# EAGLE board bmsmot (EAGLE 4.13), part 1 of 2
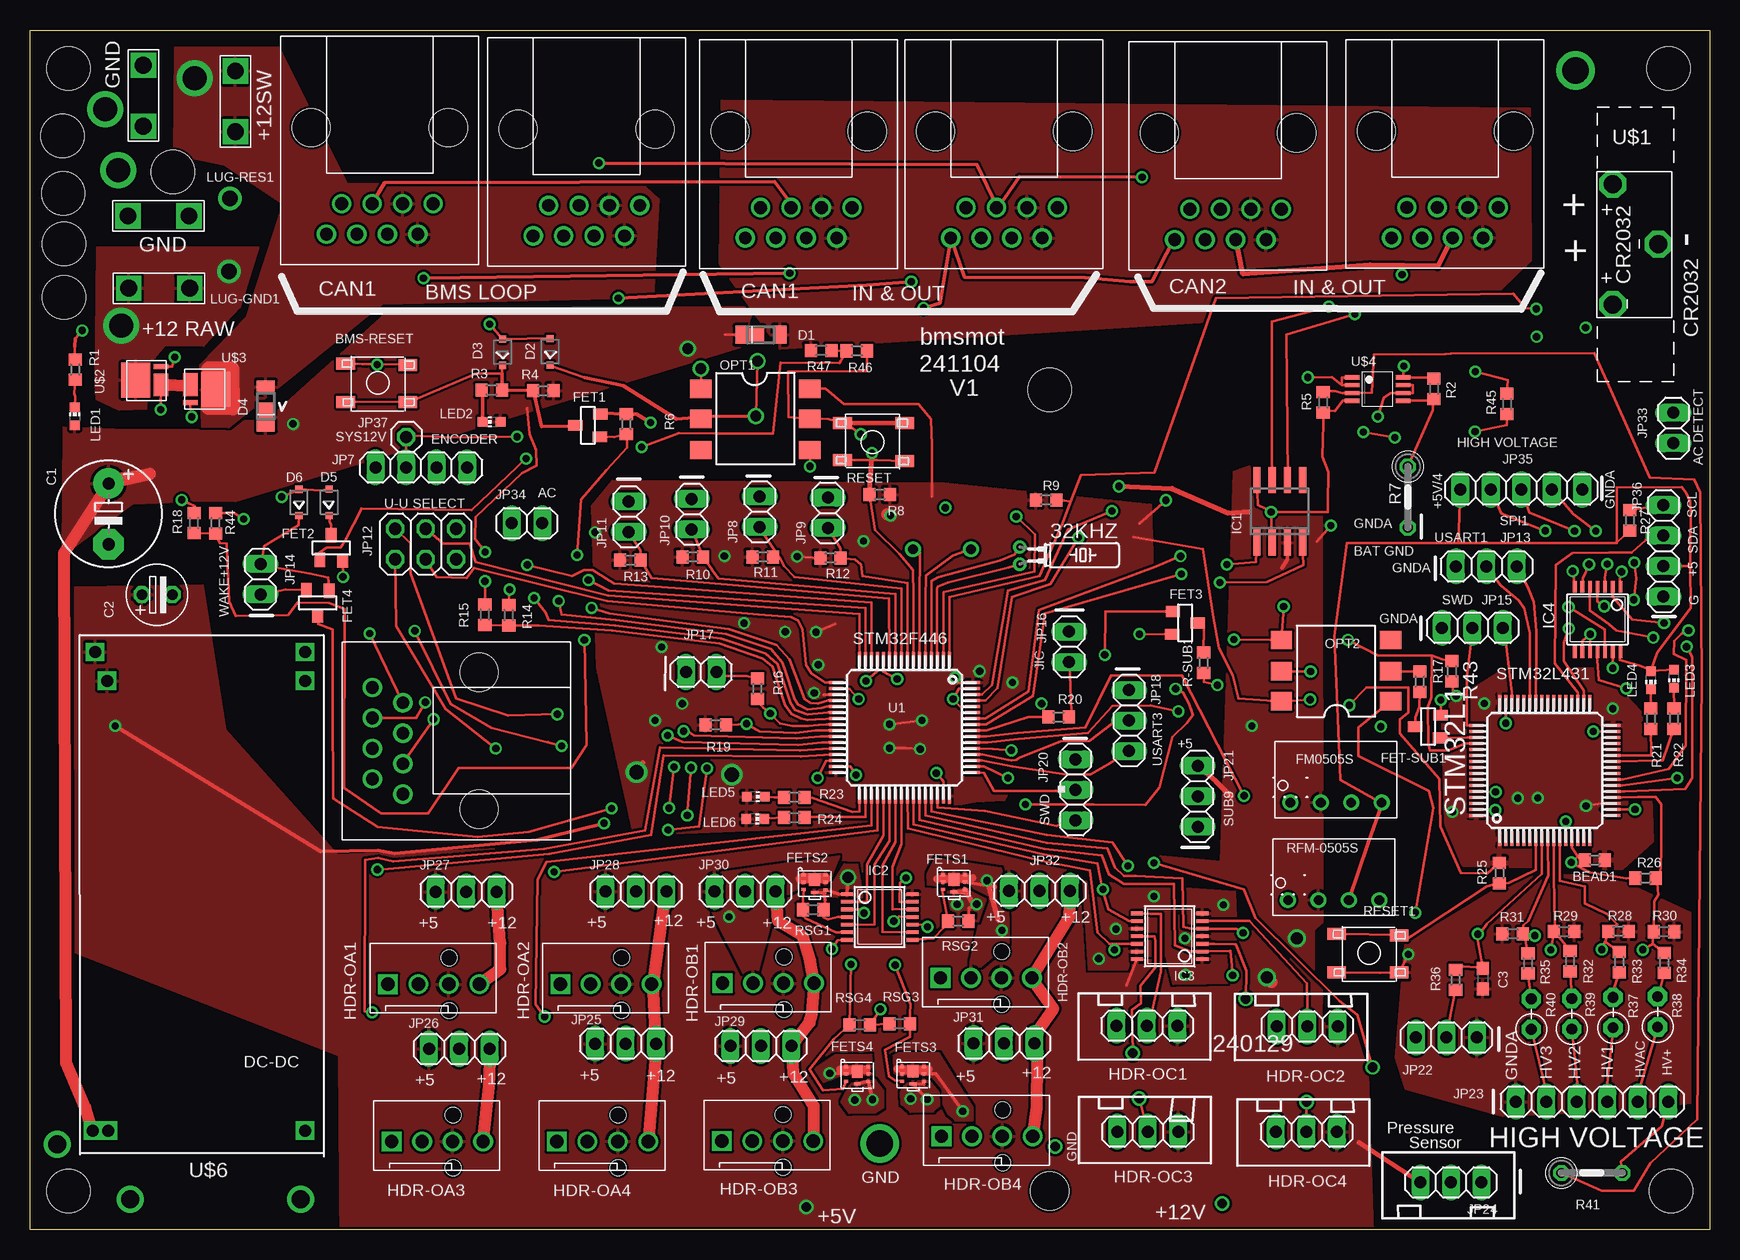
[diagram p2: board, top side]
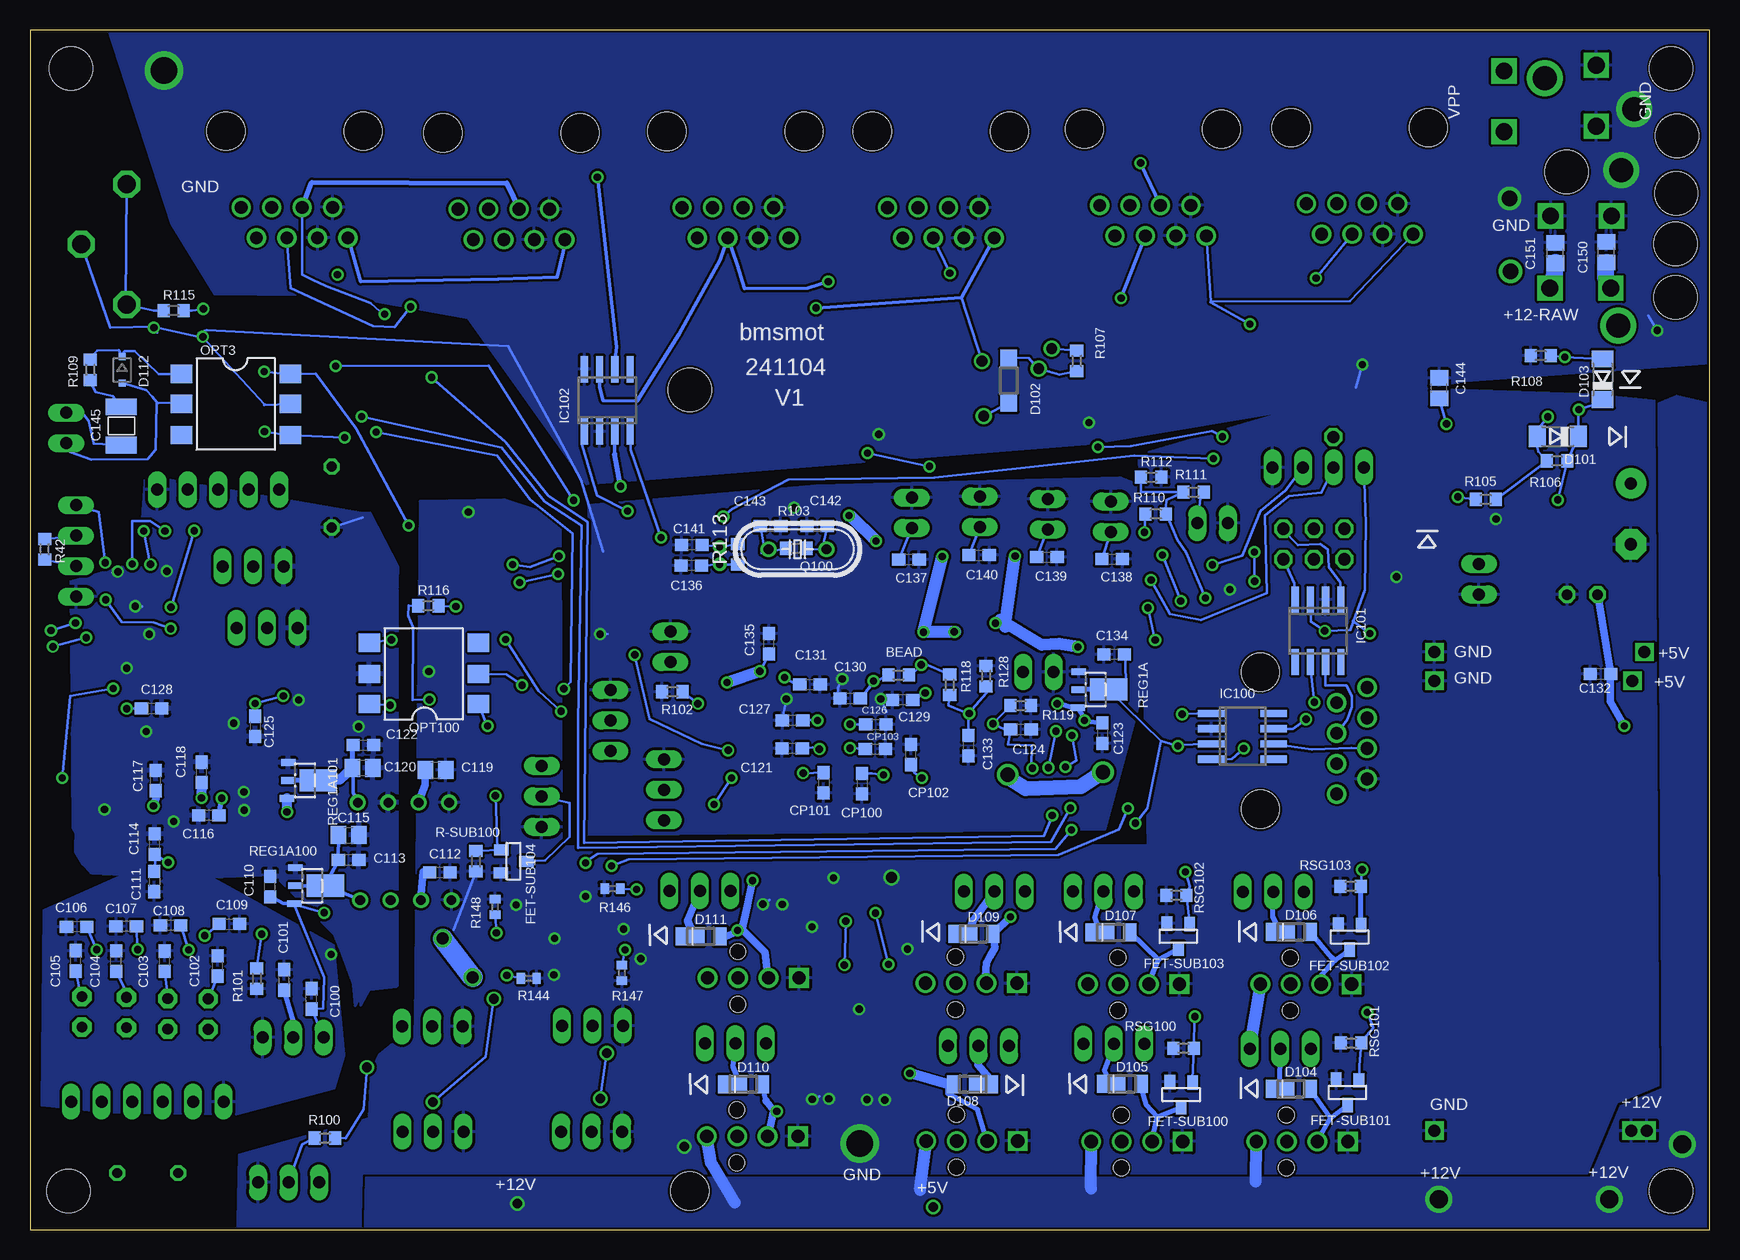
[diagram p3: board, bottom side, seen from below]

Size 140 x 100 mm. Coordinates in mm from the lower left corner, seen from the top.
Outline: 0,0 0,100 140,100 140,0 0,0
Copper layers (1*16): Top 0.035mm / dielectric 1.5mm / Bottom 0.035mm
Design rules "default": minimum track width 8mil, minimum drill 0.6mm, track to track 8mil, track to pad 8mil, pad to pad 8mil, via to via 8mil, smd to smd 0mil, copper to edge 8mil, drill to drill 8mil, minimum pad ring 10mil, minimum via ring 8mil, stop-mask expansion 4mil, vias tented up to drill 0mil, thermal gap 10mil
Holes 3.6 mm at 2.83,82.15 2.85,77.71 3.2,3.2 136.8,3.2 136.6,96.8 3.2,96.8 85,70 2.7,91.17 11.9,88.17 2.77,86.39
Holes 3.2 mm at 85,3.2

## Footprints (pad centres in the part's own frame; a part is rotated, then mirrored left to right if it is on the bottom)
32KHZ = drill 0.6 round: 1 -0.67,-3.1; 2 0.77,-3.1
SPADE_TAB = drill 1.4 square: G1 -2.54,0; G2 2.54,0
R0603 = smd 1 x 1.1: 1 -0.85,0; 2 0.85,0
E-SWITCH2 = smd 1.55 x 1: 1 -2.7,1.6; 2 2.5,1.5; 3 2.5,-1.6; 4 -2.7,-1.6
E5-8,5 = drill 1.016 pad 2.54 round: + -2.54,0 | drill 1.016 pad 2.54 octagon: - 2.54,0
ES-2,5L = drill 0.889 pad 1.27 octagon: 1 0,0; 2 2.54,0
C0603 = smd 1.1 x 1: 1 -0.85,0; 2 0.85,0
C0805 = smd 1.3 x 1.5: 1 -0.85,0; 2 0.85,0
1210 = smd 1.397 x 2.591: 1 -1.6,0; 2 1.6,0
POWERDI123 = smd 1.1 x 1.5: A 1,0 | smd 2.4 x 1.5: C -1.5,0
SOD323-R = smd 0.6 x 0.6: A 1.1,0; C -1.1,0
SOD80C = smd 1.4 x 1.8: A 1.7,0; C -1.7,0
SOD123 = smd 1.4 x 1.4: A 1.9,0; C -1.9,0
SOT-23 = smd 0.9 x 1.2: 1 -1,-1.006; 2 0.9,-1.056; 3 -0.05,1.056
DFN2020-6 = smd 0.33 x 0.25: D1 -0.925,0.4; D2 -0.925,-0.225; D5 0.925,-0.225; D6 0.925,0.4; G -0.925,-0.825; S1 0.925,-0.85 | smd 0.9 x 1.05: D7 0,0 | smd 0.56 x 0.25: S2 0,-1.05
DC-DC = drill 0.8 round: 1-GND 0,-1.27; 2-VIN 2.54,-1.27; 3-0V 5.08,-1.27; 4-VO 7.62,-1.27
1X4-MOLEXKK = drill 1.1 square: 1 3.81,0 | drill 1.1 round: 2 1.27,0; 3 -1.27,0; 4 -3.81,0 | hole 1.3: -1.3,2.2; -1.3,-2.2
1X03 = drill 1 long: 1 -2.54,0; 2 0,0; 3 2.54,0
SO-08 = smd 0.6 x 2.2: 1 -1.905,-2.6; 2 -0.635,-2.6; 3 0.635,-2.6; 4 1.905,-2.6; 5 1.905,2.6; 6 0.635,2.6; 7 -0.635,2.6; 8 -1.905,2.6
TSSOP14 = smd 0.305 x 0.991: 1 -1.905,-2.718; 2 -1.27,-2.718; 3 -0.635,-2.718; 4 0,-2.718; 5 0.635,-2.718; 6 1.27,-2.718; 7 1.905,-2.718; 8 1.905,2.718; 9 1.27,2.718; 10 0.635,2.718; 11 0,2.718; 12 -0.635,2.718; 13 -1.27,2.718; 14 -1.905,2.718
MOD8P8C = drill 1.067 pad 1.397 round: 1 -3.81,-2.54; 2 -2.54,0; 3 -1.27,-2.54; 4 0,0; 5 1.27,-2.54; 6 2.54,0; 7 3.81,-2.54; 8 5.08,0 | hole 3.175: -5.08,-8.89; 6.35,-8.89
1X04 = drill 1 long: 1 -3.81,0; 2 -1.27,0; 3 1.27,0; 4 3.81,0
1X02 = drill 1 long: 1 -1.27,0; 2 1.27,0
2X03 = drill 1.016 octagon: 1 -2.54,-1.27; 2 -2.54,1.27; 3 0,-1.27; 4 0,1.27; 5 2.54,-1.27; 6 2.54,1.27
1X06 = drill 1 long: 1 -6.35,0; 2 -3.81,0; 3 -1.27,0; 4 1.27,0; 5 3.81,0; 6 6.35,0
1X05 = drill 1.016 long: 1 -5.08,0; 2 -2.54,0; 3 0,0; 4 2.54,0; 5 5.08,0
1X01 = drill 1 octagon: 1 0,0
CHIP-LED0603 = smd 0.8 x 0.8: A 0,-0.75; C 0,0.75
SMD-6 = smd 1.52 x 1.78: P$1 -2.5,-4.5; P$2 0,-4.5; P$3 2.6,-4.5; P$4 2.6,4.6; P$5 0,4.6; P$6 -2.5,4.6
HC49/S = drill 0.813 round: 1 -2.413,0; 2 2.413,0
0207/5V = drill 0.813 octagon: 1 -2.54,0; 2 2.54,0
RS-2,5 = drill 0.889 pad 1.6 octagon: 1 0,0; 2 2.54,0
R0402 = smd 0.7 x 0.9: 1 -0.65,0; 2 0.65,0
SOT89 = smd 0.55 x 1.2: 1 -1.5,-1.4; 2 0,-1.4; 3 1.5,-1.5 | smd 1.85 x 3.1: 4 0,1.1
TQFP64 = smd 1.2 x 0.26: 1 -5.7,3.75; 2 -5.7,3.25; 3 -5.7,2.75; 4 -5.7,2.25; 5 -5.7,1.75; 6 -5.7,1.25; 7 -5.7,0.75; 8 -5.7,0.25; 9 -5.7,-0.25; 10 -5.7,-0.75; 11 -5.7,-1.25; 12 -5.7,-1.75; 13 -5.7,-2.25; 14 -5.7,-2.75; 15 -5.7,-3.25; 16 -5.7,-3.75; 33 5.7,-3.75; 34 5.7,-3.25; 35 5.7,-2.75; 36 5.7,-2.25; 37 5.7,-1.75; 38 5.7,-1.25; 39 5.7,-0.75; 40 5.7,-0.25; 41 5.7,0.25; 42 5.7,0.75; 43 5.7,1.25; 44 5.7,1.75; 45 5.7,2.25; 46 5.7,2.75; 47 5.7,3.25; 48 5.7,3.75 | smd 0.26 x 1.2: 17 -3.75,-5.7; 18 -3.25,-5.7; 19 -2.75,-5.7; 20 -2.25,-5.7; 21 -1.75,-5.7; 22 -1.25,-5.7; 23 -0.75,-5.7; 24 -0.25,-5.7; 25 0.25,-5.7; 26 0.75,-5.7; 27 1.25,-5.7; 28 1.75,-5.7; 29 2.25,-5.7; 30 2.75,-5.7; 31 3.25,-5.7; 32 3.75,-5.7; 49 3.75,5.7; 50 3.25,5.7; 51 2.75,5.7; 52 2.25,5.7; 53 1.75,5.7; 54 1.25,5.7; 55 0.75,5.7; 56 0.25,5.7; 57 -0.25,5.7; 58 -0.75,5.7; 59 -1.25,5.7; 60 -1.75,5.7; 61 -2.25,5.7; 62 -2.75,5.7; 63 -3.25,5.7; 64 -3.75,5.7
COIN = drill 1.5 pad 1.6 octagon: 1 -5.01,3.8; 2 5.01,3.8; 3 0.01,0
DFN3333-8L = smd 2.4 x 2.9: D -0.9,0.05 | smd 1.2 x 0.4: G 1.207,1.16 | smd 1.2 x 1.9: S 1.2,-0.35
VSSOP8 = smd 0.35 x 1.2: 1 -1.025,-2.125; 2 -0.375,-2.125; 3 0.275,-2.125; 4 0.925,-2.125; 5 0.925,2.125; 6 0.275,2.125; 7 -0.375,2.125; 8 -1.025,2.125
LM2569SW2 = drill 1 square: 1 0,16.4; 2 0,0; 3 37.5,0; 4 37.5,16.5; 11 0,17.7; 33 39.9,0; 44 39.9,17.5

## Placement (x,y rotation side)
32KHZ  X100  [32KHZ]  85.61,56.23 270 top
+12SW  +12-switched  [SPADE_TAB]  17.12,94.05 90 top
BEAD  1500  [R0603]  67.59,46.22 180 bottom
BEAD1  1  [R0603]  130.44,30.8 180 top
BMS-RESET  E-SWITCH2  [E-SWITCH2]  29.01,70.58 0 top
C1  100u 25v  [E5-8,5]  6.55,59.66 270 top
C2  10@25V  [ES-2,5L]  9.33,52.93 0 top
C3  .33u  [C0603]  121.09,20.92 270 top
C100  100n  [C0603]  116.54,19.23 90 bottom
C101  0.1u  [C0603]  118.8,20.81 90 bottom
C102  50n 50v  [C0603]  124.35,21.97 90 bottom
C103  50n 50v  [C0603]  128.76,22.36 90 bottom
C104  50n 50v  [C0603]  132.83,22.37 90 bottom
C105  50n 50v  [C0603]  136.17,22.4 90 bottom
C106  .33u  [C0603]  136.11,25.23 180 bottom
C107  .33u  [C0603]  131.98,25.28 180 bottom
C108  .33u  [C0603]  128.28,25.37 180 bottom
C109  .33u  [C0603]  123.38,25.46 0 bottom
C110  4.7u  [C0603]  120,28.59 90 bottom
C111  100n  [C0603]  129.63,29.01 270 bottom
C112  100n  [C0603]  105.83,29.79 0 bottom
C113  0.1u 25v  [C0603]  113.44,30.82 0 bottom
C114  1u  [C0603]  129.59,32.13 90 bottom
C115  4.7u 25v  [C0805]  113.43,32.88 0 bottom
C116  4.7u  [C0603]  125.1,34.52 180 bottom
C117  100n  [C0603]  129.52,37.43 90 bottom
C118  100n  [C0603]  125.68,38.11 90 bottom
C119  4.7  [C0805]  106.2,38.32 0 bottom
C120  4.7u 25v  [C0805]  112.28,38.5 0 bottom
C121  100n  [C0603]  76.47,40.1 180 bottom
C122  0.1u 25v  [C0603]  112.21,40.39 0 bottom
C123  4.7u  [C0603]  50.62,41.38 270 bottom
C124  4.7u 6.3v  [C0603]  57.4,41.7 0 bottom
C125  100n  [C0603]  121.24,41.95 270 bottom
C126  100n  [C0603]  69.49,42.1 0 bottom
C127  1u  [C0603]  76.44,42.45 180 bottom
C128  100n  [C0603]  129.86,43.45 0 bottom
C129  100n  [C0603]  67.26,44.15 180 bottom
C130  100n  [C0603]  71.64,44.26 180 bottom
C131  100n  [C0603]  74.98,45.43 0 bottom
C132  4.7u  [C0603]  9.09,46.3 180 bottom
C133  100n  [C0603]  61.79,40.34 270 bottom
C134  1u 25v  [C0603]  49.63,47.95 180 bottom
C135  100n  [C0603]  78.4,48.84 90 bottom
C136  10p  [C0603]  84.87,55.35 180 bottom
C137  100n  [C0603]  66.73,55.86 0 bottom
C138  100n  [C0603]  49.79,55.88 0 bottom
C139  100n  [C0603]  55.23,56.06 0 bottom
C140  100n  [C0603]  60.89,56.21 0 bottom
C141  10p  [C0603]  84.83,57.08 180 bottom
C142  15p  [C0603]  74.39,58.64 180 bottom
C143  15p  [C0603]  78.27,58.66 0 bottom
C144  4.7u  [C0805]  22.54,70.14 90 bottom
C145  20n 400v  [1210]  132.38,66.99 90 bottom
C150  4.7u  [C0805]  8.6,81.48 90 bottom
C151  4.7u  [C0805]  12.86,81.41 90 bottom
CP100  2.2u  [C0603]  70.66,37.17 270 bottom
CP101  2.2u  [C0603]  73.84,37.24 270 bottom
CP102  4.7u  [C0603]  66.55,39.6 90 bottom
CP103  4.7u  [C0603]  69.53,40.05 0 bottom
D1  Siicon diode  [POWERDI123]  61.5,74.59 0 top
D2  [SOD323-R]  43.35,73.17 90 top
D3  [SOD323-R]  39.4,73.14 90 top
D4  SBR3U60  [POWERDI123]  19.66,69.23 90 top
D5  [SOD323-R]  24.93,60.62 90 top
D6  [SOD323-R]  22.42,60.61 90 top
D101  MMSZ4699  [SOD80C]  12.65,66.12 180 bottom
D102  1N4448  [SOD123]  58.41,70.77 270 bottom
D103  MMSZ4699  [SOD80C]  8.91,70.88 90 bottom
D104  SBR3U60  [POWERDI123]  34.3,11.74 0 bottom
D105  SBR3U60  [POWERDI123]  48.37,12.15 0 bottom
D106  SBR3U60  [POWERDI123]  34.28,24.82 0 bottom
D107  SBR3U60  [POWERDI123]  49.31,24.77 0 bottom
D108  SBR3U60  [POWERDI123]  62.01,12.12 180 bottom
D109  SBR3U60  [POWERDI123]  60.74,24.65 0 bottom
D110  SBR3U60  [POWERDI123]  79.95,12.12 0 bottom
D111  SBR3U60  [POWERDI123]  83.48,24.45 0 bottom
D112  [SOD323-R]  132.32,71.66 270 bottom
FET1  NFET  [SOT-23]  46.5,67.09 90 top
FET2  NFET  [SOT-23]  25.16,56.83 0 top
FET3  NFET  [SOT-23]  96.28,50.52 270 top
FET4  NFET  [SOT-23]  23.94,52.24 180 top
FET-SUB1  NFET  [SOT-23]  116.53,41.97 90 top
FET-SUB100  NFET  [SOT-23]  44.09,11.24 180 bottom
FET-SUB101  NFET  [SOT-23]  30.22,11.43 180 bottom
FET-SUB102  NFET  [SOT-23]  30.05,24.38 180 bottom
FET-SUB103  NFET  [SOT-23]  44.33,24.45 180 bottom
FET-SUB104  NFET  [SOT-23]  99.69,30.64 270 bottom
FETS1  BUK6D  [DFN2020-6]  77.01,29.19 0 top
FETS2  BUK6D  [DFN2020-6]  65.4,29.16 0 top
FETS3  BUK6D  [DFN2020-6]  73.61,13.2 0 top
FETS4  BUK6D  [DFN2020-6]  68.95,13.19 0 top
FM0505S  DC-DC  [DC-DC]  105.06,36.87 0 top
GND  GND  [SPADE_TAB]  9.45,94.53 90 top
HDR-OA1  PINHD-1X4-MOLEXKK  [1X4-MOLEXKK]  33.64,20.45 180 top
HDR-OA2  PINHD-1X4-MOLEXKK  [1X4-MOLEXKK]  48.01,20.46 180 top
HDR-OA3  PINHD-1X4-MOLEXKK  [1X4-MOLEXKK]  33.96,7.34 180 top
HDR-OA4  PINHD-1X4-MOLEXKK  [1X4-MOLEXKK]  47.73,7.34 180 top
HDR-OB1  PINHD-1X4-MOLEXKK  [1X4-MOLEXKK]  61.55,20.54 180 top
HDR-OB2  PINHD-1X4-MOLEXKK  [1X4-MOLEXKK]  79.7,20.97 180 top
HDR-OB3  PINHD-1X4-MOLEXKK  [1X4-MOLEXKK]  61.48,7.38 180 top
HDR-OB4  PINHD-1X4-MOLEXKK  [1X4-MOLEXKK]  79.78,7.77 180 top
HDR-OC1  SUBX3  [1X03]  93.11,16.99 0 top
HDR-OC2  SUBX2  [1X03]  106.46,16.93 0 top
HDR-OC3  SUBX4  [1X03]  93.17,8.15 0 top
HDR-OC4  SUBX1  [1X03]  106.41,8.15 0 top
IC1  MCP2551  [SO-08]  104.17,59.88 0 top
IC2  74125  [TSSOP14]  70.83,26.05 270 top
IC3  74VHCT125  [TSSOP14]  95,24.45 90 top
IC4  74125  [TSSOP14]  130.67,50.87 180 top
IC100  MCP2551  [SO-08]  38.93,41.11 270 bottom
IC101  MCP2551  [SO-08]  32.64,49.91 180 bottom
IC102  MCP2551  [SO-08]  91.88,69.12 0 bottom
JP1  [MOD8P8C]  29.79,82.97 180 top
JP2  [MOD8P8C]  47.03,82.84 180 top
JP3  [MOD8P8C]  118.58,82.67 180 top
JP4  [MOD8P8C]  64.71,82.66 180 top
JP5  [MOD8P8C]  81.83,82.66 180 top
JP6  [MOD8P8C]  100.5,82.53 180 top
JP7  Encoder  [1X04]  32.61,63.53 180 top
JP8  [1X02]  60.82,59.84 90 top
JP9  [1X02]  66.5,59.75 90 top
JP10  [1X02]  55.16,59.63 90 top
JP11  [1X02]  49.9,59.42 90 top
JP12  [2X03]  32.98,57.15 0 top
JP13  [1X03]  121.4,55.28 0 top
JP14  [1X02]  19.21,54.22 90 top
JP15  SWD  [1X03]  120.24,50.16 0 top
JP16  [1X02]  86.62,48.58 270 top
JP17  [1X02]  55.95,46.48 180 top
JP18  [1X03]  91.62,42.42 270 top
JP19  [MOD8P8C]  28.54,40.11 90 top
JP20  SWD  [1X03]  87.15,36.66 270 top
JP21  [1X03]  97.35,36.11 90 top
JP22  HALL-EFFECT  [1X03]  118.08,16.01 180 top
JP23  [1X06]  130.22,10.66 0 top
JP24  [1X03]  118.44,3.93 180 top
JP25  [1X03]  49.66,15.5 0 top
JP26  [1X03]  35.79,15.06 0 top
JP27  [1X03]  36.37,28.16 0 top
JP28  [1X03]  50.51,28.17 0 top
JP29  [1X03]  60.92,15.3 0 top
JP30  [1X03]  59.62,28.18 0 top
JP31  [1X03]  81.19,15.52 0 top
JP32  [1X03]  84.15,28.23 0 top
JP33  [1X02]  136.98,66.83 90 top
JP34  [1X02]  41.42,58.88 180 top
JP35  [1X05]  124.32,61.69 180 top
JP36  I2C  [1X04]  136.16,56.58 90 top
JP37  [1X01]  31.36,66.07 0 top
LED1  [CHIP-LED0603]  3.73,67.8 0 top
LED2  [CHIP-LED0603]  38.48,67.33 90 top
LED3  [CHIP-LED0603]  137.03,45.93 180 top
LED4  [CHIP-LED0603]  135.11,45.8 180 top
LED5  [CHIP-LED0603]  60.5,36.08 270 top
LED6  [CHIP-LED0603]  60.47,34.23 270 top
LUG-GND1  +12V-RAW  [SPADE_TAB]  10.76,78.47 0 top
LUG-RES1  GND  [SPADE_TAB]  10.71,84.5 180 top
OPT1  H11L1S  [SMD-6]  60.41,67.59 270 top
OPT2  H11L1S  [SMD-6]  108.91,46.54 90 top
OPT3  H11L1S  [SMD-6]  122.89,68.83 270 bottom
OPT100  H11L1S  [SMD-6]  107.12,46.32 90 bottom
Q100  [HC49/S]  76.02,56.71 180 bottom
R1  27K  [R0603]  3.78,71.69 270 top
R2  100K  [R0603]  117.03,70.08 90 top
R3  10K  [R0603]  38.49,69.98 0 top
R4  10K  [R0603]  42.79,69.93 180 top
R5  100K  [R0603]  107.79,68.95 270 top
R6  100K  [R0603]  49.71,67.15 90 top
R7  22M  [0207/5V]  114.85,61.06 270 top
R8  10K  [R0603]  70.83,61.27 0 top
R9  1M  [R0603]  84.7,60.82 180 top
R10  10K  [R0603]  55.24,56.07 0 top
R11  10K  [R0603]  61.07,56.07 0 top
R12  10K  [R0603]  66.73,55.99 0 top
R13  10K  [R0603]  50.04,55.81 0 top
R14  33K  [R0603]  39.91,51.22 90 top
R15  120K  [R0603]  37.92,51.26 90 top
R16  10K  [R0603]  60.64,45.08 90 top
R17  1.8K  [R0603]  115.85,45.68 90 top
R18  120K  [R0603]  13.68,58.9 90 top
R19  10K  [R0603]  57.16,42.07 0 top
R20  100K  [R0603]  85.74,42.72 0 top
R21  6.8K  [R0603]  135.11,42.58 270 top
R22  27K  [R0603]  137.04,42.59 270 top
R23  6.8K  [R0603]  63.72,36.03 0 top
R24  3.3K  [R0603]  63.72,34.35 0 top
R25  10K  [R0603]  122.49,29.71 270 top
R26  10K  [R0603]  134.68,29.3 180 top
R27  3.3k  [R0603]  133.36,59.12 270 top
R28  10K  [R0603]  132.41,24.86 0 top
R29  10K  [R0603]  127.88,24.85 0 top
R30  10K  [R0603]  136.2,24.83 0 top
R31  10K  [R0603]  123.59,24.65 180 top
R32  110K  [R0603]  128.38,22.37 90 top
R33  110K  [R0603]  132.48,22.3 90 top
R34  110K  [R0603]  136.23,22.23 90 top
R35  110K  [R0603]  124.87,22.19 90 top
R36  5.6K  [R0603]  118.83,20.81 90 top
R37  1M  [RS-2,5]  131.96,16.82 90 top
R38  1M  [RS-2,5]  135.67,16.88 90 top
R39  1M  [RS-2,5]  128.52,16.71 90 top
R40  1M  [RS-2,5]  125.14,16.69 90 top
R41  22M  [0207/5V]  130.19,4.71 0 top
R42  3.3k  [R0603]  138.78,56.71 270 bottom
R43  1.8K  [R0603]  118.52,46.53 270 top
R44  33K  [R0603]  15.47,58.89 90 top
R45  5.6K  [R0603]  123.11,68.82 90 top
R46  33K  [R0603]  68.93,73.25 0 top
R47  120K  [R0603]  65.95,73.28 180 top
R100  5.6K  [R0603]  115.41,7.63 180 bottom
R101  10K  [R0603]  121.1,20.92 270 bottom
R102  100K  [R0603]  86.45,44.83 0 bottom
R103  470K  [R0603]  76.12,56.79 0 bottom
R105  100K  [R0603]  18.65,60.87 180 bottom
R106  1M  [R0603]  12.71,64.08 180 bottom
R107  3.3K  [R0603]  52.75,72.41 270 bottom
R108  100K  [R0603]  14.06,72.86 180 bottom
R109  10K  [R0603]  134.97,71.67 90 bottom
R110  12K  [R0603]  46.16,59.65 180 bottom
R111  100K  [R0603]  43.01,61.47 180 bottom
R112  10K  [R0603]  46.53,62.72 0 bottom
R113  18M  [R0603]  81,56.3 90 bottom
R115  18K  [R0603]  128.02,76.61 0 bottom
R116  1.8K  [R0603]  106.79,52 0 bottom
R118  10K  [R0603]  63.34,45.41 270 bottom
R119  10K  [R0603]  57.42,43.68 180 bottom
R128  10K  [R0603]  60.31,46.14 270 bottom
R144  1M  [R0402]  98.42,20.94 0 bottom
R146  1M  [R0402]  91.44,28.41 180 bottom
R147  1M  [R0402]  90.66,21.4 270 bottom
R148  1M  [R0402]  101.23,26.89 90 bottom
R-SUB1  1.8K  [R0603]  97.83,47.24 270 top
R-SUB100  2.2M  [R0603]  102.83,30.7 270 bottom
REG1A  AP7380Y  [SOT89]  51.18,45.01 270 bottom
REG1A100  AP7380Y  [SOT89]  116.47,28.66 270 bottom
REG1A101  AP7380Y  [SOT89]  117.07,37.44 270 bottom
RESET  E-SWITCH2  [E-SWITCH2]  70.23,65.65 180 top
RESET1  E-SWITCH2  [E-SWITCH2]  111.63,23.03 0 top
RFM-0505S  DC-DC  [DC-DC]  104.86,28.74 0 top
RSG1  2.2M  [R0603]  65.28,26.67 0 top
RSG2  2.2M  [R0603]  77.38,25.71 0 top
RSG3  2.2M  [R0603]  72.5,17.15 180 top
RSG4  2.2M  [R0603]  69.16,17.07 0 top
RSG100  2.2M  [R0603]  43.85,15.11 180 bottom
RSG101  2.2M  [R0603]  29.87,15.56 180 bottom
RSG102  2.2M  [R0603]  44.44,27.86 180 bottom
RSG103  2.2M  [R0603]  29.92,28.61 180 bottom
STM32L1  STM32L431RXT6  [TQFP64]  126.26,38.27 90 top
U1  STM32F10XRXT6  [TQFP64]  72.89,41.84 270 top
U$1  COIN  [COIN]  135.73,82.12 90 top
U$2  PJQ4403P  [DFN3333-8L]  9.72,70.77 0 top
U$3  PJQ4403P  [DFN3333-8L]  14.57,70.09 180 top
U$4  TVL522  [VSSOP8]  112.32,70.01 270 top
U$6  LM2596-2  [LM2569SW2]  22.92,8.25 90 top